# Altium project VESC6.PrjPcb
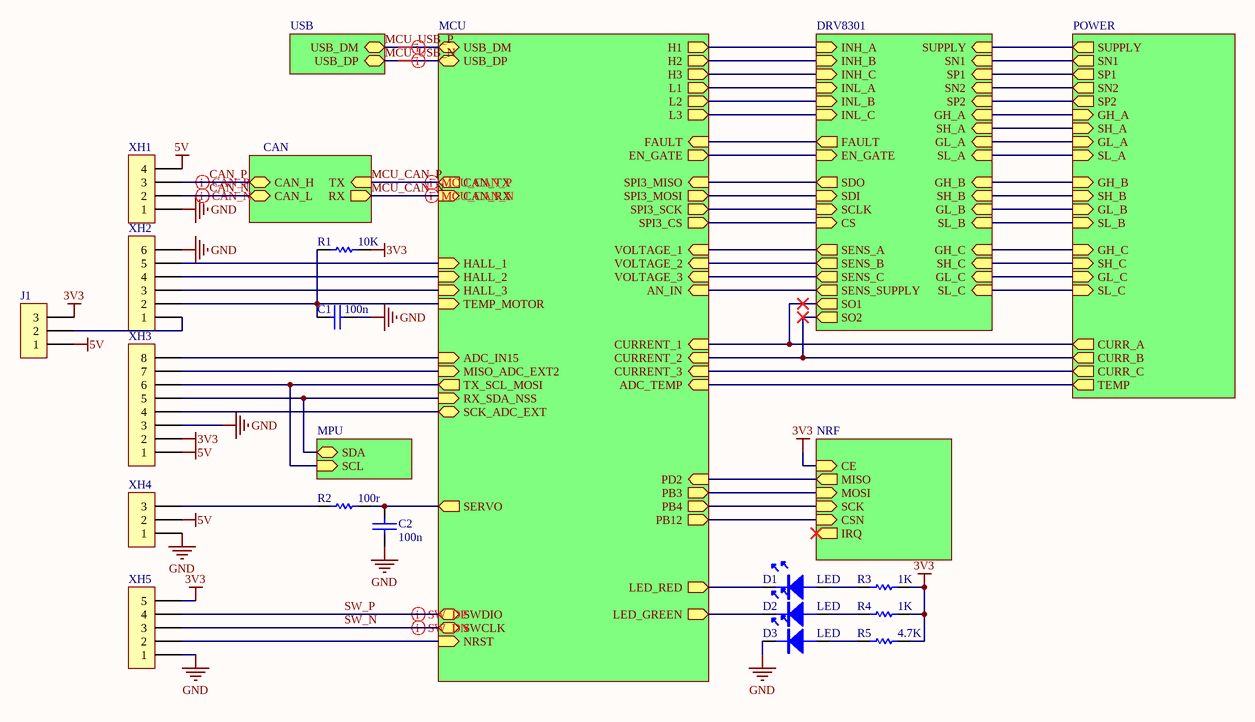
[diagram p0: VESC6.SchDoc]
8 sheets, 187 parts. Net scope: hierarchical (ports join the sheet entries above them; power ports are global).
Board file: VESC6.PcbDoc
Sheets:
  VESC6.SchDoc
    MCU = MCU.SchDoc
    DRV8301 = drv8301.SchDoc
    POWER = power.SchDoc
    NRF = nrf.SchDoc
    CAN = can.SchDoc
    MPU = MPU.SchDoc
    USB = USB.SchDoc

## Sheet VESC6.SchDoc
size A4; SheetNumber: 1; SheetTotal: 8

### Parts
C1  100n  [0603C]
C2  100n  [0603C]
D1  LED  [LED-0603Y]
D2  LED  [LED-0603Y]
D3  LED  [LED-0603Y]
J1  Pin HDR1X3  [Pin HDR1X3/2.54mm-S]  (value not drawn)
R1  10K  [0603R]
R2  100r  [0603R]
R3  1K  [0603R]
R4  1K  [0603R]
R5  4.7K  [0603R]
XH1  XH4  [XH4/2.54mm/90]  (value not drawn)
XH2  XH6  [XH6/2.54mm/90]  (value not drawn)
XH3  XH8  [XH8/2.54mm/90]  (value not drawn)
XH4  XH3  [XH3/2.54mm/90]  (value not drawn)
XH5  XH5  [XH5/2.54mm/90]  (value not drawn)

### Sub-sheets
CAN = can: TX (in), RX (out), CAN_H (bidir), CAN_L (bidir)
DRV8301 = drv8301.SchDoc: INH_A (in), INH_B (in), INH_C (in), INL_A (in), INL_B (in), INL_C (in), FAULT (out), EN_GATE (in), SDO (out), SDI (in), SCLK (in), CS (in), SENS_A (out), SENS_B (out), SENS_C (out), SENS_SUPPLY (out), SUPPLY (in), GH_A (in), SH_A (in), GL_A (in), SL_A (in), GH_B (in), SH_B (in), GL_B (in), SL_B (in), GH_C (in), SH_C (in), GL_C (in), SL_C (in), SN1 (in), SN2 (in), SP1 (in), SP2 (in), SO1 (out), SO2 (out)
MCU = MCU.SchDoc: H1 (out), H2 (out), H3 (out), L1 (out), L2 (out), L3 (out), FAULT (in), EN_GATE (out), SPI3_MISO (in), SPI3_MOSI (out), SPI3_SCK (out), SPI3_CS (out), VOLTAGE_1 (in), VOLTAGE_2 (in), VOLTAGE_3 (in), AN_IN (in), CURRENT_1 (in), CURRENT_2 (in), CURRENT_3 (in), ADC_TEMP (in), PD2 (in), PB3 (out), PB4 (out), PB12 (out), LED_RED (out), LED_GREEN (out), USB_DM (bidir), USB_DP (bidir), CAN_TX (out), CAN_RX (in), HALL_1 (in), HALL_2 (in), HALL_3 (in), TEMP_MOTOR (in), ADC_IN15 (in), MISO_ADC_EXT2 (in), TX_SCL_MOSI (out), RX_SDA_NSS (in), SCK_ADC_EXT (bidir), SERVO (out), SWCLK (bidir), SWDIO (bidir), NRST (in)
MPU = mpu: SCL (in), SDA (bidir)
NRF = nrf.schdoc: MISO (out), MOSI (in), SCK (in), CSN (in), IRQ (out), CE (in)
POWER = power: SUPPLY (out), GH_A (in), SH_A (in), GL_A (in), SL_A (in), GH_B (in), SH_B (in), GL_B (in), SL_B (in), GH_C (in), SH_C (in), GL_C (in), SL_C (in), CURR_A (out), CURR_B (out), CURR_C (out), TEMP (out), SN1 (out), SN2 (out), SP1 (out), SP2 (out)
USB = USB: USB_DM (bidir), USB_DP (bidir)

### Nets
3V3: J1.3 R1.2 R3.2 R4.2 R5.2 XH3.2 XH5.5 ; sheet NRF/CE
5V: J1.1 XH1.4 XH3.1 XH4.2
GND: C1.2 C2.1 D3.K XH1.1 XH2.6 XH3.3 XH4.1 XH5.1
PGND: sheet DRV8301/SL_A, sheet DRV8301/SP1, sheet DRV8301/SP2, sheet POWER/SL_A, sheet POWER/SP1, sheet POWER/SP2
SUPPLY: sheet DRV8301/SUPPLY, sheet POWER/SUPPLY
CAN_N: XH1.2 ; sheet CAN/CAN_L
CAN_P: XH1.3 ; sheet CAN/CAN_H
GH_A: sheet DRV8301/GH_A, sheet POWER/GH_A
GL_A: sheet DRV8301/GL_A, sheet POWER/GL_A
MCU_CAN_N: sheet MCU/CAN_RX, sheet CAN/RX
MCU_CAN_P: sheet MCU/CAN_TX, sheet CAN/TX
MCU_USB_N: sheet MCU/USB_DP, sheet USB/USB_DP
MCU_USB_P: sheet MCU/USB_DM, sheet USB/USB_DM
SENS_A: sheet MCU/VOLTAGE_1, sheet DRV8301/SENS_A
SENS_B: sheet MCU/VOLTAGE_2, sheet DRV8301/SENS_B
SENS_C: sheet MCU/VOLTAGE_3, sheet DRV8301/SENS_C
SENS_SUPPLY: sheet MCU/AN_IN, sheet DRV8301/SENS_SUPPLY
SH_A: sheet DRV8301/SH_A, sheet POWER/SH_A
SH_B: sheet DRV8301/SH_B, sheet POWER/SH_B
SH_C: sheet DRV8301/SH_C, sheet POWER/SH_C
SW_N: XH5.3 ; sheet MCU/SWCLK
SW_P: XH5.4 ; sheet MCU/SWDIO
TEMP: sheet MCU/ADC_TEMP, sheet POWER/TEMP
NetC1_1: C1.1 R1.1 XH2.2 ; sheet MCU/TEMP_MOTOR
NetC2_2: C2.2 R2.2 ; sheet MCU/SERVO
NetC12_1: XH5.2 ; sheet MCU/NRST
NetC16_1: sheet DRV8301/SL_B, sheet DRV8301/SN1, sheet POWER/SL_B, sheet POWER/SN1
NetC18_1: sheet DRV8301/SL_C, sheet DRV8301/SN2, sheet POWER/SL_C, sheet POWER/SN2
NetC23_2: sheet MCU/CURRENT_1, sheet DRV8301/SO1, sheet POWER/CURR_A
NetC25_2: sheet MCU/CURRENT_2, sheet DRV8301/SO2, sheet POWER/CURR_B
NetC26_2: sheet MCU/CURRENT_3, sheet POWER/CURR_C
NetD1_A: D1.A R3.1
NetD1_K: D1.K ; sheet MCU/LED_RED
NetD2_A: D2.A R4.1
NetD2_K: D2.K ; sheet MCU/LED_GREEN
NetD3_A: D3.A R5.1
NetJ1_2: J1.2 XH2.1
NetR2_1: R2.1 XH4.3
NetR8_1: sheet DRV8301/GH_B, sheet POWER/GH_B
NetR9_1: sheet DRV8301/GH_C, sheet POWER/GH_C
NetR14_1: sheet DRV8301/GL_B, sheet POWER/GL_B
NetR15_1: sheet DRV8301/GL_C, sheet POWER/GL_C
NetR35_1: XH3.6 ; sheet MCU/TX_SCL_MOSI, sheet MPU/SCL
NetR36_1: XH3.5 ; sheet MCU/RX_SDA_NSS, sheet MPU/SDA
NetU1_21: XH3.4 ; sheet MCU/SCK_ADC_EXT
NetU1_22: XH3.7 ; sheet MCU/MISO_ADC_EXT2
NetU1_25: XH3.8 ; sheet MCU/ADC_IN15
NetU1_33: sheet MCU/PB12, sheet NRF/CSN
NetU1_34: sheet MCU/L1, sheet DRV8301/INL_A
NetU1_35: sheet MCU/L2, sheet DRV8301/INL_B
NetU1_36: sheet MCU/L3, sheet DRV8301/INL_C
NetU1_37: XH2.5 ; sheet MCU/HALL_1
NetU1_38: XH2.4 ; sheet MCU/HALL_2
NetU1_39: XH2.3 ; sheet MCU/HALL_3
NetU1_40: sheet MCU/SPI3_CS, sheet DRV8301/CS
NetU1_41: sheet MCU/H1, sheet DRV8301/INH_A
NetU1_42: sheet MCU/H2, sheet DRV8301/INH_B
NetU1_43: sheet MCU/H3, sheet DRV8301/INH_C
NetU1_51: sheet MCU/SPI3_SCK, sheet DRV8301/SCLK
NetU1_52: sheet MCU/SPI3_MISO, sheet DRV8301/SDO
NetU1_53: sheet MCU/SPI3_MOSI, sheet DRV8301/SDI
NetU1_54: sheet MCU/PD2, sheet NRF/MISO
NetU1_55: sheet MCU/PB3, sheet NRF/MOSI
NetU1_56: sheet MCU/PB4, sheet NRF/SCK
NetU1_57: sheet MCU/EN_GATE, sheet DRV8301/EN_GATE
NetU1_59: sheet MCU/FAULT, sheet DRV8301/FAULT

### Layout directives
differential pair: CAN_N, CAN_P, MCU_CAN_N, MCU_CAN_P, MCU_USB_N, MCU_USB_P, SW_N, SW_P

### Library data of the parts
C1 C2 = CAP: 无极性电容
R1-R5 = RES

## Sheet MCU.SchDoc
size A4; SheetNumber: 2; SheetTotal: 8
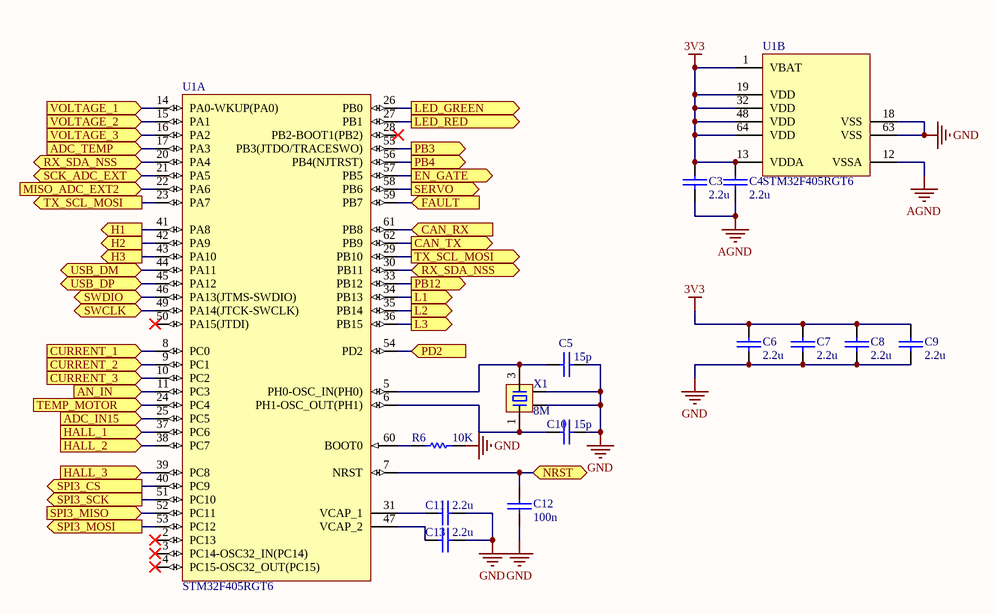
[diagram p1: MCU.SchDoc]

### Parts
C3  2.2u  [0603C]
C4  2.2u  [0603C]
C5  15p  [0603C]
C6  2.2u  [0603C]
C7  2.2u  [0603C]
C8  2.2u  [0603C]
C9  2.2u  [0603C]
C10  15p  [0603C]
C11  2.2u  [0603C]
C12  100n  [0603C]
C13  2.2u  [0603C]
R6  10K  [0603R]
U1  STM32F405RGT6  [STM-LQFP64_N]  (parts A,B of 2)
X1  8M  [OSC 5032-4P]

### Ports
ADC_IN15 (in), ADC_TEMP (in), AN_IN (in), CAN_RX (in), CAN_TX (out), CURRENT_1 (in), CURRENT_2 (in), CURRENT_3 (in), EN_GATE (out), FAULT (in), H1 (out), H2 (out), H3 (out), HALL_1 (in), HALL_2 (in), HALL_3 (in), L1 (out), L2 (out), L3 (out), LED_GREEN (out), LED_RED (out), MISO_ADC_EXT2 (in), NRST (bidir), PB3 (out), PB4 (out), PB12 (out), PD2 (in), RX_SDA_NSS (bidir), SCK_ADC_EXT (bidir), SERVO (out), SPI3_CS (out), SPI3_MISO (in), SPI3_MOSI (out), SPI3_SCK (out), SWCLK (bidir), SWDIO (bidir), TEMP_MOTOR (in), TX_SCL_MOSI (out), USB_DM (bidir), USB_DP (bidir), VOLTAGE_1 (in), VOLTAGE_2 (in), VOLTAGE_3 (in)

### Nets
3V3: C3.1 C4.1 C6.1 C7.1 C8.1 C9.1 U1.1(VBAT) U1.13(VDDA) U1.19(VDD) U1.32(VDD) U1.48(VDD) U1.64(VDD)
AGND: C3.2 C4.2 U1.12(VSSA)
GND: C5.1 C6.2 C7.2 C8.2 C9.2 C10.1 C11.1 C12.2 C13.1 R6.2 U1.18(VSS) U1.63(VSS) X1.2 X1.4
MCU_CAN_N: U1.61(PB8) ; port CAN_RX
MCU_CAN_P: U1.62(PB9) ; port CAN_TX
MCU_USB_N: U1.45(PA12) ; port USB_DP
MCU_USB_P: U1.44(PA11) ; port USB_DM
SENS_A: U1.14(PA0-WKUP(PA0)) ; port VOLTAGE_1
SENS_B: U1.15(PA1) ; port VOLTAGE_2
SENS_C: U1.16(PA2) ; port VOLTAGE_3
SENS_SUPPLY: U1.11(PC3) ; port AN_IN
SW_N: U1.49(PA14(JTCK-SWCLK)) ; port SWCLK
SW_P: U1.46(PA13(JTMS-SWDIO)) ; port SWDIO
TEMP: U1.17(PA3) ; port ADC_TEMP
NetC1_1: U1.24(PC4) ; port TEMP_MOTOR
NetC2_2: U1.58(PB6) ; port SERVO
NetC5_2: C5.2 U1.5(PH0-OSC_IN(PH0)) X1.3
NetC10_2: C10.2 U1.6(PH1-OSC_OUT(PH1)) X1.1
NetC11_2: C11.2 U1.31(VCAP_1)
NetC12_1: C12.1 U1.7(NRST) ; port NRST
NetC13_2: C13.2 U1.47(VCAP_2)
NetC23_2: U1.8(PC0) ; port CURRENT_1
NetC25_2: U1.9(PC1) ; port CURRENT_2
NetC26_2: U1.10(PC2) ; port CURRENT_3
NetD1_K: U1.27(PB1) ; port LED_RED
NetD2_K: U1.26(PB0) ; port LED_GREEN
NetR6_1: R6.1 U1.60(BOOT0)
NetR35_1: U1.23(PA7) U1.29(PB10) ; port TX_SCL_MOSI
NetR36_1: U1.20(PA4) U1.30(PB11) ; port RX_SDA_NSS
NetU1_21: U1.21(PA5) ; port SCK_ADC_EXT
NetU1_22: U1.22(PA6) ; port MISO_ADC_EXT2
NetU1_25: U1.25(PC5) ; port ADC_IN15
NetU1_33: U1.33(PB12) ; port PB12
NetU1_34: U1.34(PB13) ; port L1
NetU1_35: U1.35(PB14) ; port L2
NetU1_36: U1.36(PB15) ; port L3
NetU1_37: U1.37(PC6) ; port HALL_1
NetU1_38: U1.38(PC7) ; port HALL_2
NetU1_39: U1.39(PC8) ; port HALL_3
NetU1_40: U1.40(PC9) ; port SPI3_CS
NetU1_41: U1.41(PA8) ; port H1
NetU1_42: U1.42(PA9) ; port H2
NetU1_43: U1.43(PA10) ; port H3
NetU1_51: U1.51(PC10) ; port SPI3_SCK
NetU1_52: U1.52(PC11) ; port SPI3_MISO
NetU1_53: U1.53(PC12) ; port SPI3_MOSI
NetU1_54: U1.54(PD2) ; port PD2
NetU1_55: U1.55(PB3(JTDO/TRACESWO)) ; port PB3
NetU1_56: U1.56(PB4(NJTRST)) ; port PB4
NetU1_57: U1.57(PB5) ; port EN_GATE
NetU1_59: U1.59(PB7) ; port FAULT

Not connected (* = marked no-connect by the designer): U1 2(PC13)* 3(PC14-OSC32_IN(PC14))* 4(PC15-OSC32_OUT(PC15))* 28(PB2-BOOT1(PB2))* 50(PA15(JTDI))*

### Library data of the parts
C3-C13 = CAP: 无极性电容
R6 = RES
U1 = CMP-0243-00019-3: ARM Cortex-M4 32-bit MCU+FPU, 210 DMIPS, 1024 kB Flash, 192 kB Internal RAM, 51 I/Os, 64-pin LQFP, -40 to 85 degC, Tray; Manufacturer: STMicroelectronics; Supply Voltage(Vcc) min (V): 1.8; Supply Voltage(Vcc) max (V): 3.6; Internal RAM Size (kB): 192; I/Os (High Current): 51; D/A Converter: 2x12-bit; FLASH Size (Prog) (kB): 1024; Operating Frequency(F) (Processor speed) (MHz): 168; ComponentLink2Description: Datasheet; PackageVersion: Rev. 4, 06/2013; DatasheetVersion: Rev. 4; Core: ARM Cortex-M4; ComponentLink2URL: http://www.st.com/st-web-ui/static/active/en/resource/technical/document/datasheet/DM00037051.pdf; PackageReference: LQFP64; Packing: Tray; ComponentLink1Description: Manufacturer URL; ComponentLink3URL: http://www.st.com/st-web-ui/static/active/en/resource/technical/document/datasheet/DM00037051.pdf; ComponentLink3Description: Package Specification; Mounting Technology: Surface Mount; ComponentLink1URL: http://www.st.com/web/en/home.html; PackageDescription: 64-Pin Low Profile Quad Flat Package, 10 x 10 mm Body, 0.5 mm Pitch; PartNumber: STM32F405RGT6
X1 = XTAL-4P: 4脚无源晶振

## Sheet drv8301.SchDoc
size A4; SheetNumber: 4; SheetTotal: 8
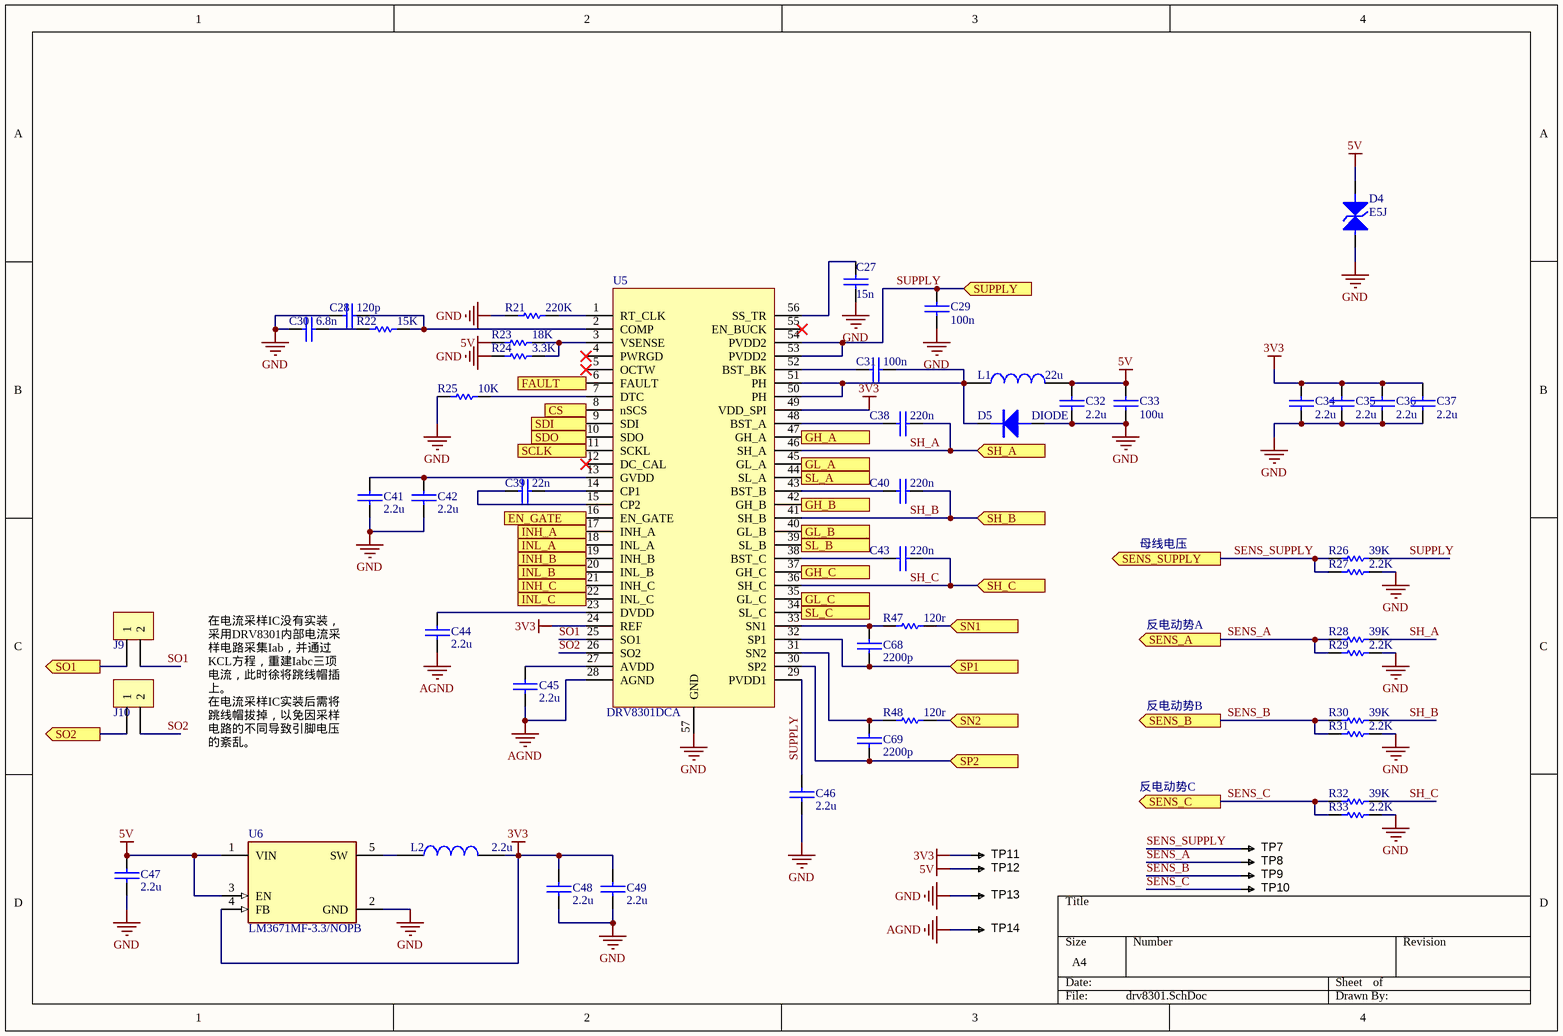
[diagram p2: drv8301.SchDoc]

### Parts
C27  15n  [0603C]
C28  120p  [0603C]
C29  100n  [0603C]
C30  6.8n  [0603C]
C31  100n  [0603C]
C32  2.2u  [0603C]
C33  100u  [0603C]
C34  2.2u  [0603C]
C35  2.2u  [0603C]
C36  2.2u  [0603C]
C37  2.2u  [0603C]
C38  220n  [0603C]
C39  22n  [0603C]
C40  220n  [0603C]
C41  2.2u  [0603C]
C42  2.2u  [0603C]
C43  220n  [0603C]
C44  2.2u  [0603C]
C45  2.2u  [0603C]
C46  2.2u  [0603C]
C47  2.2u  [0603C]
C48  2.2u  [0603C]
C49  2.2u  [0603C]
C68  2200p  [0603C]
C69  2200p  [0603C]
D4  E5J  [SOD-123]
D5  DIODE  [SMA/DO-214AC]
J9  Pin HDR1X2  [Pin HDR1X2/2.54mm-S]  (value not drawn)
J10  Pin HDR1X2  [Pin HDR1X2/2.54mm-S]  (value not drawn)
L1  22u  [0630L]
L2  2.2u  [0630L]
R21  220K  [0603R]
R22  15K  [0603R]
R23  18K  [0603R]
R24  3.3K  [0603R]
R25  10K  [0603R]
R26  39K  [0603R]
R27  2.2K  [0603R]
R28  39K  [0603R]
R29  2.2K  [0603R]
R30  39K  [0603R]
R31  2.2K  [0603R]
R32  39K  [0603R]
R33  2.2K  [0603R]
R47  120r  [0603R]
R48  120r  [0603R]
TP7  TESTPOINT  [FIDUCIAL]  (value not drawn)  (no BOM)
TP8  TESTPOINT  [FIDUCIAL]  (value not drawn)  (no BOM)
TP9  TESTPOINT  [FIDUCIAL]  (value not drawn)  (no BOM)
TP10  TESTPOINT  [FIDUCIAL]  (value not drawn)  (no BOM)
TP11  TESTPOINT  [FIDUCIAL]  (value not drawn)  (no BOM)
TP12  TESTPOINT  [FIDUCIAL]  (value not drawn)  (no BOM)
TP13  TESTPOINT  [FIDUCIAL]  (value not drawn)  (no BOM)
TP14  TESTPOINT  [FIDUCIAL]  (value not drawn)  (no BOM)
U5  DRV8301DCA  [TSSOP50P810X120_HS-57N]
U6  LM3671MF-3.3/NOPB  [FP-DBV0005A-MFG]

### Ports
CS (in), EN_GATE (in), FAULT (out), GH_A (in), GH_B (in), GH_C (in), GL_A (in), GL_B (in), GL_C (in), INH_A (in), INH_B (in), INH_C (in), INL_A (in), INL_B (in), INL_C (in), SCLK (in), SDI (in), SDO (out), SENS_A (out), SENS_B (out), SENS_C (out), SENS_SUPPLY (out), SH_A (in), SH_B (in), SH_C (in), SL_A (in), SL_B (in), SL_C (in), SN1 (in), SN2 (in), SO1 (out), SO2 (out), SP1 (in), SP2 (in), SUPPLY (in)

### Nets
3V3: C34.1 C35.1 C36.1 C37.1 C48.2 C49.2 L2.2 TP11.1 U5.24(REF) U5.49(VDD_SPI) U6.4(FB)
5V: C32.1 C33.1 C47.2 D4.K L1.2 R23.1 TP12.1 U6.1(VIN) U6.3(EN)
AGND: C44.1 C45.1 TP14.1 U5.28(AGND)
GND: C27.2 C28.2 C29.2 C30.2 C32.2 C33.2 C34.2 C35.2 C36.2 C37.2 C41.1 C42.1 C46.1 C47.1 C48.1 C49.1 D4.A D5.A R21.2 R24.2 R25.2 R27.1 R29.1 R31.1 R33.1 TP13.1 U5.57(GND) U6.2(GND)
PGND: C68.1 C69.1 U5.30(SP2) U5.32(SP1) U5.44(SL_A) ; port SL_A, port SP2, port SP1
SUPPLY: C29.1 C46.2 R26.1 U5.29(PVDD1) U5.53(PVDD2) U5.54(PVDD2) ; port SUPPLY
GH_A: U5.47(GH_A) ; port GH_A
GL_A: U5.45(GL_A) ; port GL_A
SENS_A: R28.2 R29.2 TP8.1 ; port SENS_A
SENS_B: R30.2 R31.2 TP9.1 ; port SENS_B
SENS_C: R32.2 R33.2 TP10.1 ; port SENS_C
SENS_SUPPLY: R26.2 R27.2 TP7.1 ; port SENS_SUPPLY
SH_A: C38.1 R28.1 U5.46(SH_A) ; port SH_A
SH_B: C40.1 R30.1 U5.41(SH_B) ; port SH_B
SH_C: C43.1 R32.1 U5.36(SH_C) ; port SH_C
SO1: J9.2 U5.25(SO1)
SO2: J10.2 U5.26(SO2)
NetC16_1: R47.1 U5.39(SL_B) ; port SL_B, port SN1
NetC18_1: R48.1 U5.34(SL_C) ; port SL_C, port SN2
NetC23_2: J9.1 ; port SO1
NetC25_2: J10.1 ; port SO2
NetC27_1: C27.1 U5.56(SS_TR)
NetC28_1: C28.1 R22.1 U5.2(COMP)
NetC30_1: C30.1 R22.2
NetC31_1: C31.1 D5.K L1.1 U5.50(PH) U5.51(PH)
NetC31_2: C31.2 U5.52(BST_BK)
NetC38_2: C38.2 U5.48(BST_A)
NetC39_1: C39.1 U5.14(CP1)
NetC39_2: C39.2 U5.15(CP2)
NetC40_2: C40.2 U5.43(BST_B)
NetC41_2: C41.2 C42.2 U5.13(GVDD)
NetC43_2: C43.2 U5.38(BST_C)
NetC44_2: C44.2 U5.23(DVDD)
NetC45_2: C45.2 U5.27(AVDD)
NetC68_2: C68.2 R47.2 U5.33(SN1)
NetC69_2: C69.2 R48.2 U5.31(SN2)
NetL2_1: L2.1 U6.5(SW)
NetR8_1: U5.42(GH_B) ; port GH_B
NetR9_1: U5.37(GH_C) ; port GH_C
NetR14_1: U5.40(GL_B) ; port GL_B
NetR15_1: U5.35(GL_C) ; port GL_C
NetR21_1: R21.1 U5.1(RT_CLK)
NetR23_2: R23.2 R24.1 U5.3(VSENSE)
NetR25_1: R25.1 U5.7(DTC)
NetU1_34: U5.18(INL_A) ; port INL_A
NetU1_35: U5.20(INL_B) ; port INL_B
NetU1_36: U5.22(INL_C) ; port INL_C
NetU1_40: U5.8(nSCS) ; port CS
NetU1_41: U5.17(INH_A) ; port INH_A
NetU1_42: U5.19(INH_B) ; port INH_B
NetU1_43: U5.21(INH_C) ; port INH_C
NetU1_51: U5.11(SCKL) ; port SCLK
NetU1_52: U5.10(SDO) ; port SDO
NetU1_53: U5.9(SDI) ; port SDI
NetU1_57: U5.16(EN_GATE) ; port EN_GATE
NetU1_59: U5.6(FAULT) ; port FAULT

Not connected (* = marked no-connect by the designer): U5 4(PWRGD)* 5(OCTW)* 12(DC_CAL)* 55(EN_BUCK)*

### Notes on the sheet
- 母线电压
- 反电动势A
- 反电动势B
- 在电流采样IC没有实装，采用DRV8301内部电流采样电路采集Iab，并通过KCL方程，重建Iabc三项电流，此时徐将跳线帽插上。
  在电流采样IC实装后需将跳线帽拔掉，以免因采样电路的不同导致引脚电压的紊乱。
- 反电动势C

### Library data of the parts
C27-C49 C68 C69 = CAP: 无极性电容
D4 = TVS: 双向瞬态抑制二极管
D5 = DIODE: 普通二极管
L1 L2 = INDUCTOR
R21-R33 R47 R48 = RES
TP7-TP14 = TESTPOINT: SMD test pin
U6 = CMP-0063-01132-4: IC REG BUCK 3.3V 600MA SOT23-5; Number of Outputs: 1; Min Supply Voltage: 2.7V; Frequency: 2MHz; Min Output Voltage: 1.1V; Max Supply Voltage: 5.5V; Output Type: Fixed; Switching Frequency: 2.6MHz; Quiescent Current: 16uA; Case/Package: SOT-23; Number of Pins: 5; Lead Free: Lead Free; Min Operating Temperature: -40°C; Length: 2.92mm; Packaging: Tape and Reel; Max Output Current: 600mA; Height: 1.02mm; Max Operating Temperature: 85°C; Mount: Surface Mount; REACH SVHC: No SVHC; Contact Plating: Tin; Output Current: 600mA; Min Input Voltage: 2.7V; RoHS Compliant: Yes; Output Voltage: 3.3V; Package Quantity: 1000; Max Output Voltage: 3.3V; Nominal Output Voltage: 3.3V; Width: 1.6mm; Max Input Voltage: 5.5V; Termination: SMD/SMT

## Sheet power.SchDoc
size A4; SheetNumber: 3; SheetTotal: 8
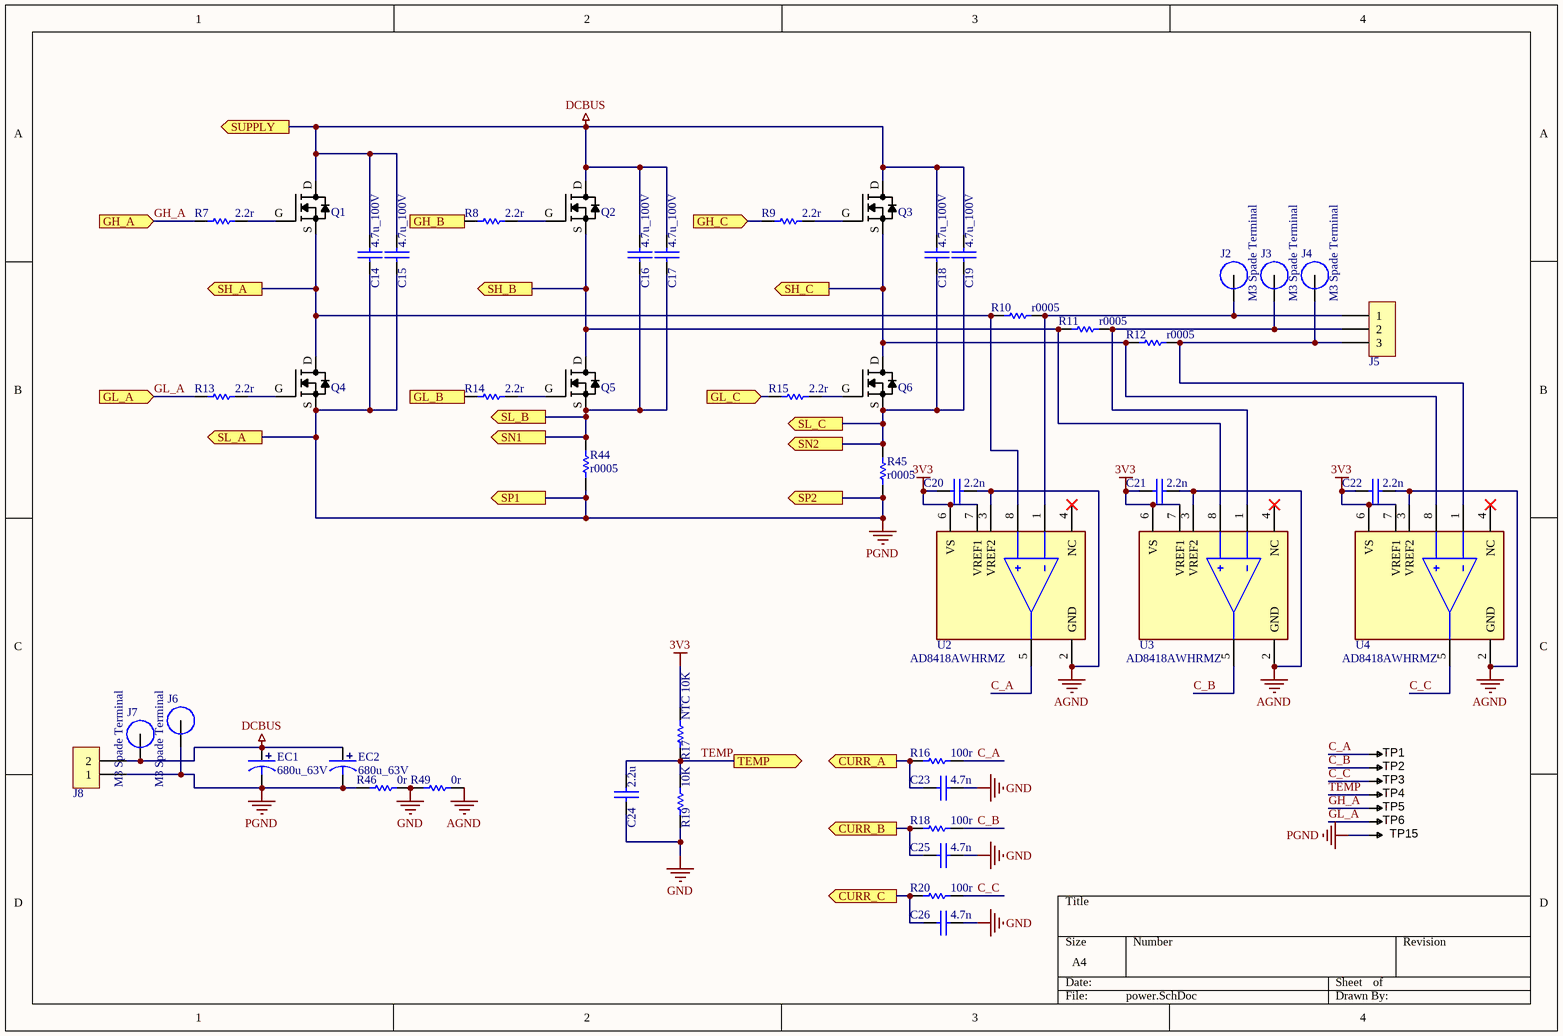
[diagram p3: power.SchDoc]

### Parts
C14  4.7u_100V  [1206C]
C15  4.7u_100V  [1206C]
C16  4.7u_100V  [1206C]
C17  4.7u_100V  [1206C]
C18  4.7u_100V  [1206C]
C19  4.7u_100V  [1206C]
C20  2.2n  [0603C]
C21  2.2n  [0603C]
C22  2.2n  [0603C]
C23  4.7n  [0603C]
C24  2.2u  [0603C]
C25  4.7n  [0603C]
C26  4.7n  [0603C]
EC1  680u_63V  [DIP-EC5.0X12.5X25]
EC2  680u_63V  [DIP-EC5.0X12.5X25]
J2  M3 Spade Terminal  [M3 Spade Hole]
J3  M3 Spade Terminal  [M3 Spade Hole]
J4  M3 Spade Terminal  [M3 Spade Hole]
J5  1704936  [1704936]  (value not drawn)
J6  M3 Spade Terminal  [M3 Spade Hole]
J7  M3 Spade Terminal  [M3 Spade Hole]
J8  1868076  [1868076]  (value not drawn)
Q1  FILL_FOOTPRINT  [SO8FL_VIAS]  (value not drawn)
Q2  FILL_FOOTPRINT  [SO8FL_VIAS]  (value not drawn)
Q3  FILL_FOOTPRINT  [SO8FL_VIAS]  (value not drawn)
Q4  FILL_FOOTPRINT  [SO8FL_VIAS]  (value not drawn)
Q5  FILL_FOOTPRINT  [SO8FL_VIAS]  (value not drawn)
Q6  FILL_FOOTPRINT  [SO8FL_VIAS]  (value not drawn)
R7  2.2r  [0603R]
R8  2.2r  [0603R]
R9  2.2r  [0603R]
R10  r0005  [2512R]
R11  r0005  [2512R]
R12  r0005  [2512R]
R13  2.2r  [0603R]
R14  2.2r  [0603R]
R15  2.2r  [0603R]
R16  100r  [0603R]
R17  NTC 10K  [0603R]
R18  100r  [0603R]
R19  10K  [0603R]
R20  100r  [0603R]
R44  r0005  [2512R]
R45  r0005  [2512R]
R46  0r  [0603R]
R49  0r  [0603R]
TP1  TESTPOINT  [FIDUCIAL]  (value not drawn)  (no BOM)
TP2  TESTPOINT  [FIDUCIAL]  (value not drawn)  (no BOM)
TP3  TESTPOINT  [FIDUCIAL]  (value not drawn)  (no BOM)
TP4  TESTPOINT  [FIDUCIAL]  (value not drawn)  (no BOM)
TP5  TESTPOINT  [FIDUCIAL]  (value not drawn)  (no BOM)
TP6  TESTPOINT  [FIDUCIAL]  (value not drawn)  (no BOM)
TP15  TESTPOINT  [FIDUCIAL]  (value not drawn)  (no BOM)
U2  AD8418AWHRMZ  [FP-RM-8-IPC_A]
U3  AD8418AWHRMZ  [FP-RM-8-IPC_A]
U4  AD8418AWHRMZ  [FP-RM-8-IPC_A]

### Ports
CURR_A (out), CURR_B (out), CURR_C (out), GH_A (in), GH_B (in), GH_C (in), GL_A (in), GL_B (in), GL_C (in), SH_A (out), SH_B (out), SH_C (out), SL_A (out), SL_B (out), SL_C (out), SN1 (out), SN2 (out), SP1 (out), SP2 (out), SUPPLY (out), TEMP (out)

### Nets
3V3: C20.2 C21.2 C22.2 R17.2 U2.6(VS) U2.7(VREF1) U3.6(VS) U3.7(VREF1) U4.6(VS) U4.7(VREF1)
AGND: C20.1 C21.1 C22.1 R49.1 U2.2(GND) U2.3(VREF2) U3.2(GND) U3.3(VREF2) U4.2(GND) U4.3(VREF2)
DCBUS: C14.2 C15.2 C16.2 C17.2 C18.2 C19.2 EC1.1 EC2.1 J7.1 J8.2 Q1.D Q2.D Q3.D ; port SUPPLY  [project net SUPPLY]
GND: C23.1 C24.1 C25.1 C26.1 R19.1 R46.1 R49.2
PGND: C14.1 C15.1 EC1.2 EC2.2 J6.1 J8.1 Q4.S R44.2 R45.2 R46.2 TP15.1 ; port SL_A, port SP1, port SP2
C_A: R16.1 TP1.1 U2.5(OUT)
C_B: R18.1 TP2.1 U3.5(OUT)
C_C: R20.1 TP3.1 U4.5(OUT)
GH_A: R7.1 TP5.1 ; port GH_A
GL_A: R13.1 TP6.1 ; port GL_A
SH_A: Q1.S Q4.D R10.2 U2.8(+IN) ; port SH_A
SH_B: Q2.S Q5.D R11.2 U3.8(+IN) ; port SH_B
SH_C: Q3.S Q6.D R12.2 U4.8(+IN) ; port SH_C
TEMP: C24.2 R17.1 R19.2 TP4.1 ; port TEMP
NetC16_1: C16.1 C17.1 Q5.S R44.1 ; port SL_B, port SN1
NetC18_1: C18.1 C19.1 Q6.S R45.1 ; port SL_C, port SN2
NetC23_2: C23.2 R16.2 ; port CURR_A
NetC25_2: C25.2 R18.2 ; port CURR_B
NetC26_2: C26.2 R20.2 ; port CURR_C
NetJ2_1: J2.1 J5.1 R10.1 U2.1(-IN)
NetJ3_1: J3.1 J5.2 R11.1 U3.1(-IN)
NetJ4_1: J4.1 J5.3 R12.1 U4.1(-IN)
NetQ1_G: Q1.G R7.2
NetQ2_G: Q2.G R8.2
NetQ3_G: Q3.G R9.2
NetQ4_G: Q4.G R13.2
NetQ5_G: Q5.G R14.2
NetQ6_G: Q6.G R15.2
NetR8_1: R8.1 ; port GH_B
NetR9_1: R9.1 ; port GH_C
NetR14_1: R14.1 ; port GL_B
NetR15_1: R15.1 ; port GL_C

Not connected (* = marked no-connect by the designer): U2 4(NC)*; U3 4(NC)*; U4 4(NC)*

### Library data of the parts
C14-C26 = CAP: 无极性电容
EC1 EC2 = DIP_ECAP: 直插电解电容
J5 = 1704936: CONN TERM BLOCK 3POS 7.62MM; Manufacturer: Phoenix Contact; Number of Levels: 1; Positions Per Level: 3; Pitch: 0.300" (7.62mm); Mating Orientation: Horizontal with Board; Current: 30A; Voltage: 300V; Wire Gauge: 10-30 AWG; Wire Termination: Screw - Rising Cage Clamp; Torque - Screw: 0.5-0.6 Nm (4.4-5.3 Lb-In); Screw Thread: M3; Supplier 1: Digi-Key; Supplier Part Number 1: 277-5954-ND; RoHS: RoHS Compliant; Category: Connectors, Interconnects; Stock: 3559; Pricing 1: 1=2.19, 10=2.128, 50=1.989, 100=1.8299, 250=1.69064, 500=1.61108, 1000=1.482 (USD); Packaging: Bulk; Part Status: Active; Mounting Type: Through Hole; Features: Interlocking (Side); Color: Green; Operating Temperature: -; Housing Material: Polyamide (PA), Nylon; Contact Material - Plating: -; Clamp Material - Plating: -; Screw Material - Plating: -; ComponentLink1URL: http://media.digikey.com/PDF/Data%20Sheets/Phoenix%20Contact%20PDFs/1704936.pdf; ComponentLink1Description: http://media.digikey.com/PDF/Data%20Sheets/Phoenix%20Contact%20PDFs/1704936.pdf; Manufacturer Part Number: 1704936
J8 = 1868076: CONN TERM BLOCK 2POS 7.62MM; Manufacturer: Phoenix Contact; Number of Levels: 1; Positions Per Level: 2; Pitch: 0.300" (7.62mm); Mating Orientation: Horizontal with Board; Current: 30A; Voltage: 300V; Wire Gauge: 10-30 AWG; Wire Termination: Screw - Rising Cage Clamp; Torque - Screw: 0.5-0.6 Nm (4.4-5.3 Lb-In); Screw Thread: M3; Supplier 1: Digi-Key; Supplier Part Number 1: 277-5840-ND; RoHS: RoHS Compliant; Category: Connectors, Interconnects; Stock: 2175; Pricing 1: 1=1.56, 10=1.517, 50=1.4178, 100=1.3044, 250=1.20512, 500=1.14842, 1000=1.0564 (USD); Packaging: Bulk; Part Status: Active; Mounting Type: Through Hole; Features: Interlocking (Side); Color: Green; Operating Temperature: -; Housing Material: Polyamide (PA), Nylon; Contact Material - Plating: -; Clamp Material - Plating: -; Screw Material - Plating: -; ComponentLink1URL: http://media.digikey.com/PDF/Data%20Sheets/Phoenix%20Contact%20PDFs/1868076.pdf; ComponentLink1Description: http://media.digikey.com/PDF/Data%20Sheets/Phoenix%20Contact%20PDFs/1868076.pdf
Q1-Q6 = NTMFS4935NT1G_1: MOSFET N-CH 30V 13A SO8FL; Manufacturer: ON Semiconductor; FET Type: N-Channel; Current - Continuous Drain (Id) @ 25°C: 13A (Ta), 93A (Tc); Drive Voltage (Max Rds On,  Min Rds On): 4.5V, 10V; Vgs(th) (Max) @ Id: 2.2V @ 250µA; Gate Charge (Qg) (Max) @ Vgs: 49.4nC @ 10V; Input Capacitance (Ciss) (Max) @ Vds: 4850pF @ 15V; Vgs (Max): ±20V; Power Dissipation (Max): 930mW (Ta), 48W (Tc); Rds On (Max) @ Id, Vgs: 3.2 mOhm @ 30A, 10V; Supplier 1: Digi-Key; Supplier Part Number 1: NTMFS4935NT1GOSCT-ND; RoHS: RoHS Compliant; Category: Discrete Semiconductor Products; Stock 1: 932; Pricing 1: 1=0.61, 10=0.541, 100=0.4145, 500=0.3277 (USD); Packaging: Cut Tape (CT); Part Status: Active; Technology: MOSFET (Metal Oxide); Drain to Source Voltage (Vdss): 30V; FET Feature: -; Operating Temperature: -55°C ~ 150°C (TJ); Mounting Type: Surface Mount; Supplier Device Package: 5-DFN (5x6) (8-SOFL); Package / Case: 8-PowerTDFN, 5 Leads; ComponentLink1URL: http://www.onsemi.com/pub_link/Collateral/NTMFS4935N-D.PDF; ComponentLink1Description: http://www.onsemi.com/pub_link/Collateral/NTMFS4935N-D.PDF; Manufacturer Part Number: NTMFS4935NT1G
R7-R20 R44-R46 R49 = RES
TP1-TP6 TP15 = TESTPOINT: SMD test pin
U2-U4 = CMP-09116-000167-1: IC CURR SENSE 1 CIRCUIT 8MSOP; Input Offset Voltage (Vos): 200uV; Number of Circuits: 1; Operating Supply Current: 4.1mA; Common Mode Rejection Ratio: 90dB; Input Bias Current: 130uA; Min Dual Supply Voltage: 1.35V; Max Dual Supply Voltage: 2.75V; Slew Rate: 1V/µs; Min Supply Voltage: 2.7V; Max Supply Voltage: 5.5V; -3db Bandwidth: 250kHz; Power Supply Rejection Ratio (PSRR): 80dB; Input Capacitance: 2pF; Number of Pins: 8; Max Operating Temperature: 125°C; Lead Free: Contains Lead; Mount: Surface Mount; Case/Package: MSOP; Min Operating Temperature: -40°C; Contact Plating: Tin; Packaging: Rail/Tube; RoHS Compliant: Yes

## Sheet nrf.SchDoc
size A4; SheetNumber: 5; SheetTotal: 8
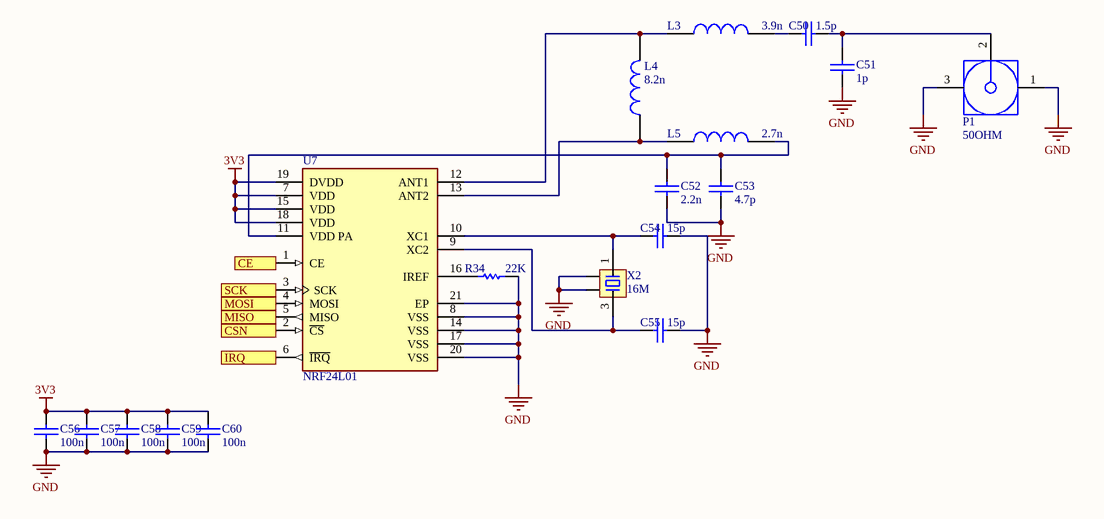
[diagram p4: nrf.SchDoc]

### Parts
C50  1.5p  [0603C]
C51  1p  [0603C]
C52  2.2n  [0603C]
C53  4.7p  [0603C]
C54  15p  [0603C]
C55  15p  [0603C]
C56  100n  [0603C]
C57  100n  [0603C]
C58  100n  [0603C]
C59  100n  [0603C]
C60  100n  [0603C]
L3  3.9n  [0603L]
L4  8.2n  [0603L]
L5  2.7n  [0603L]
P1  50OHM  [IPEX]
R34  22K  [0603R]
U7  NRF24L01  [FP-NRF24L01-IPC_C]
X2  16M  [OSC 3225-4P]

### Ports
CE (in), CSN (in), IRQ (out), MISO (out), MOSI (in), SCK (in)

### Nets
3V3: C56.2 C57.2 C58.2 C59.2 C60.2 U7.1(CE) U7.7(VDD) U7.15(VDD) U7.18(VDD) U7.19(DVDD) ; port CE
GND: C51.2 C52.1 C53.1 C54.1 C55.1 C56.1 C57.1 C58.1 C59.1 C60.1 P1.1 P1.3 R34.2 U7.8(VSS) U7.14(VSS) U7.17(VSS) U7.20(VSS) U7.21(EP) X2.2 X2.4
NetC50_1: C50.1 C51.1 P1.2
NetC50_2: C50.2 L3.2
NetC52_2: C52.2 C53.2 L5.2 U7.11(VDD_PA)
NetC54_2: C54.2 U7.10(XC1) X2.1
NetC55_2: C55.2 U7.9(XC2) X2.3
NetL3_1: L3.1 L4.2 U7.12(ANT1)
NetL4_1: L4.1 L5.1 U7.13(ANT2)
NetR34_1: R34.1 U7.16(IREF)
NetU1_33: U7.2(~{CS}) ; port CSN
NetU1_54: U7.5(MISO) ; port MISO
NetU1_55: U7.4(MOSI) ; port MOSI
NetU1_56: U7.3(SCK) ; port SCK
NetU7_6: U7.6(~{IRQ}) ; port IRQ

### Library data of the parts
C50-C60 = CAP: 无极性电容
L3-L5 = INDUCTOR
P1 = IPEX: RF Coaxial PCB Connector, MCX; Thru-Hole, Right-Angle Mount Socket, Blunt Post Terminal, 50 Ohm Impedance; PCB_Layout: Complies with manufacturer's recommendation.; DrillSize: Corresponds to nominal value.; Published: 15-Jul-2004; LatestRevisionDate: 15-Jul-2004; LatestRevisionNote: Component Replaced.; DatasheetDocument: 30-May-2003; PackageDocument: 04-Jul-1999; PackageReference: 919-119J-51AX; Publisher: Altium Limited; ComponentLink1Description: Manufacturer Link; ComponentLink1URL: http://www.amphenolrf.com/
R34 = RES
U7 = CMP-228436-000003-1: IC RF TXRX ISM>1GHZ 20VFQFN
X2 = XTAL-4P: 4脚无源晶振

## Sheet can.SchDoc
size A4; SheetNumber: 7; SheetTotal: 8
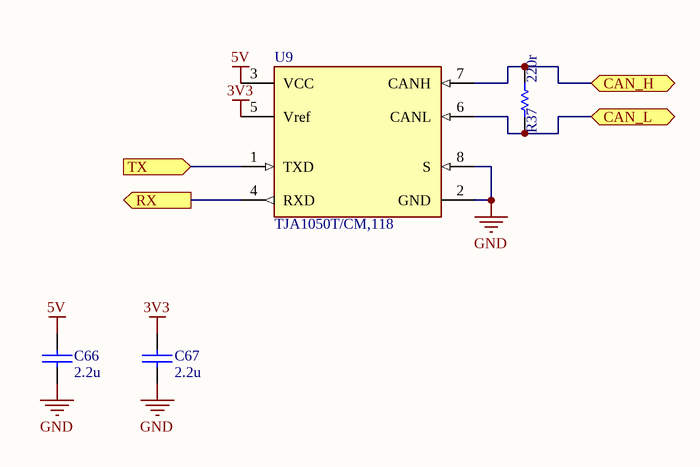
[diagram p5: can.SchDoc]

### Parts
C66  2.2u  [0603C]
C67  2.2u  [0603C]
R37  220r  [0603R]
U9  TJA1050T/CM,118  [FP-SOT96-1-IPC_A]

### Ports
CAN_H (bidir), CAN_L (bidir), RX (out), TX (in)

### Nets
3V3: C67.2 U9.5(Vref)
5V: C66.2 U9.3(VCC)
GND: C66.1 C67.1 U9.2(GND) U9.8(S)
CAN_N: R37.1 U9.6(CANL) ; port CAN_L
CAN_P: R37.2 U9.7(CANH) ; port CAN_H
MCU_CAN_N: U9.4(RXD) ; port RX
MCU_CAN_P: U9.1(TXD) ; port TX

### Library data of the parts
C66 C67 = CAP: 无极性电容
R37 = RES
U9 = CMP-2000-04923-2: IC TRANSCEIVER HALF 1/1 8SO; Simplex/Duplex: Half Duplex; Max Supply Current: 10mA; Number of Receive Buffers: 1; Min Supply Voltage: 4.75V; Max Supply Voltage: 5.25V; Interface: CAN; Data Rate: 1Mbps; Receiver Hysteresis: 70mV; Number of Transmit Buffers: 1; Min Operating Temperature: -40°C; Case/Package: SO; REACH SVHC: No SVHC; Max Operating Temperature: 150°C; Number of Pins: 8; Lead Free: Lead Free; Number of Transceivers: 1; Packaging: Tape and Reel; Mount: Surface Mount; Radiation Hardening: No; Nominal Supply Current: 10mA; Package Quantity: 2500; Contact Plating: Gold

## Sheet MPU.SchDoc
size A4; SheetNumber: 6; SheetTotal: 8
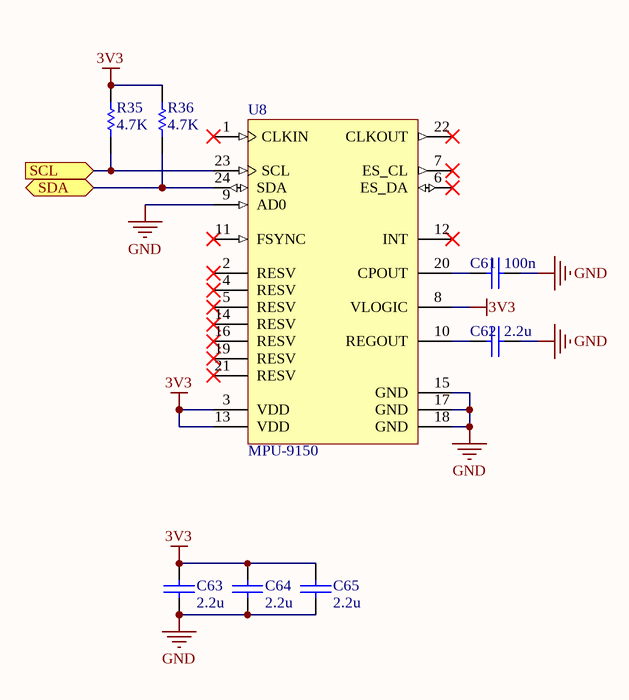
[diagram p6: MPU.SchDoc]

### Parts
C61  100n  [0603C]
C62  2.2u  [0603C]
C63  2.2u  [0603C]
C64  2.2u  [0603C]
C65  2.2u  [0603C]
R35  4.7K  [0603R]
R36  4.7K  [0603R]
U8  MPU-9150  [IS-QFN-24_4000X4000X1100_V]

### Ports
SCL (in), SDA (bidir)

### Nets
3V3: C63.2 C64.2 C65.2 R35.2 R36.2 U8.3(VDD) U8.8(VLOGIC) U8.13(VDD)
GND: C61.2 C62.2 C63.1 C64.1 C65.1 U8.9(AD0) U8.15(GND) U8.17(GND) U8.18(GND)
NetC61_1: C61.1 U8.20(CPOUT)
NetC62_1: C62.1 U8.10(REGOUT)
NetR35_1: R35.1 U8.23(SCL) ; port SCL
NetR36_1: R36.1 U8.24(SDA) ; port SDA

Not connected (* = marked no-connect by the designer): U8 1(CLKIN)* 2(RESV)* 4(RESV)* 5(RESV)* 6(ES_DA)* 7(ES_CL)* 11(FSYNC)* 12(INT)* 14(RESV)* 16(RESV)* 19(RESV)* 21(RESV)* 22(CLKOUT)*

### Library data of the parts
C61-C65 = CAP: 无极性电容
R35 R36 = RES
U8 = CMP-2000-05158-1: 9-Axis MotionTracking Device, 2.375 to 3.465 V, -40 to 85 degC, 24-Pin QFN, RoHS, Tape and Reel; Manufacturer: InvenSense; Featured Product: MPU-9150Nine-Axis(Gyro+Accelerometer+Compass)MEMSMotionTracking™Device; Output Type: I²C; PCN Obsolescence/ EOL: MPU-9150Devices25/Mar/2015; Sensor Type: Accelerometer,Gyroscope,Magnetometer,3Axis; Other Names: 1428-1009-2 / MPU9150; For Use With: 1471-1460-ND / -MPU9DOFCLICK / 1568-1017-ND / -MPU-9150GYROACCELIMU9DOF / 1428-1010-ND / -BOARDEVALFORMPU-9150; Manufacturer URL: http://www.invensense.com/; Category: Sensors,Transducers; Operating Temperature: -40degC~85degC(TA); Datasheet URL: http://datasheet.octopart.com/MPU-9150-InvenSense-datasheet-11519227.pdf; Series: MotionTracking™; Datasheet Version: Rev. 4.0, 05/2012; Family: Multifunction; Standard Package: 5,000

## Sheet USB.SchDoc
size A4; SheetNumber: 8; SheetTotal: 8
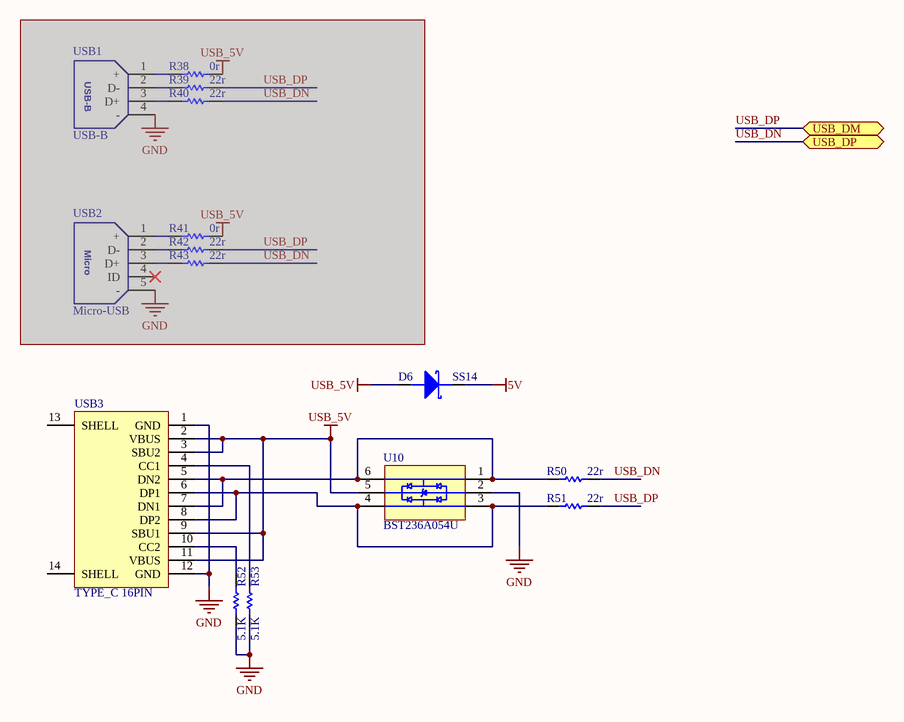
[diagram p7: USB.SchDoc]

### Parts
D6  SS14  [SMA/DO-214AC]
R38  0r  [0603R]  (masked out: inside a compile mask, not in the netlist)
R39  22r  [0603R]  (masked out: inside a compile mask, not in the netlist)
R40  22r  [0603R]  (masked out: inside a compile mask, not in the netlist)
R41  0r  [0603R]  (masked out: inside a compile mask, not in the netlist)
R42  22r  [0603R]  (masked out: inside a compile mask, not in the netlist)
R43  22r  [0603R]  (masked out: inside a compile mask, not in the netlist)
R50  22r  [0603R]
R51  22r  [0603R]
R52  5.1K  [0603R]
R53  5.1K  [0603R]
U10  BST236A054U  [SOT23-6M]
USB1  USB-B  [USB-B/S_A]  (masked out: inside a compile mask, not in the netlist)
USB2  Micro-USB  [USB-MICRO_A]  (masked out: inside a compile mask, not in the netlist)
USB3  TYPE_C 16PIN  [USB-C-SMD_TYPE-C-6PIN-2MD-073]

### Ports
USB_DM (bidir), USB_DP (bidir)

### Nets
5V: D6.K
GND: R52.1 R53.1 U10.2 USB3.1(GND) USB3.12(GND)
USB_5V: D6.A U10.5 USB3.2(VBUS) USB3.3(SBU2) USB3.9(SBU1) USB3.11(VBUS)
USB_DN: R50.2 ; port USB_DP  [project net MCU_USB_N]
USB_DP: R51.2 ; port USB_DM  [project net MCU_USB_P]
NetR50_1: R50.1 U10.1 U10.6 USB3.5(DN2) USB3.7(DN1)
NetR51_1: R51.1 U10.3 U10.4 USB3.6(DP1) USB3.8(DP2)
NetR52_2: R52.2 USB3.10(CC2)
NetR53_2: R53.2 USB3.4(CC1)

Not connected (* = marked no-connect by the designer): USB3 13(SHELL) 14(SHELL)

### Notes on the sheet
- (in symbol Micro-USB) Micro

### Library data of the parts
D6 = DIODE SCHOTTKY: 肖特基二极管
R38-R43 R50-R53 = RES
USB3 = TYPE-C 16PIN

## Nets that join several sheets
3V3: VESC6 (7 pins), MCU (12 pins), drv8301 (11 pins), power (10 pins), nrf (10 pins), can (C67.2 U9.5), MPU (8 pins)
5V: VESC6 (J1.1 XH1.4 XH3.1 XH4.2), drv8301 (9 pins), can (C66.2 U9.3), USB (D6.K)
AGND: MCU (C3.2 C4.2 U1.12), drv8301 (C44.1 C45.1 TP14.1 U5.28), power (10 pins)
GND: VESC6 (8 pins), MCU (14 pins), drv8301 (28 pins), power (7 pins), nrf (20 pins), can (C66.1 C67.1 U9.2 U9.8), MPU (9 pins), USB (5 pins)
PGND: drv8301 (5 pins), power (11 pins)
SUPPLY: drv8301 (6 pins), power (13 pins)
CAN_N: VESC6 (XH1.2), can (R37.1 U9.6)
CAN_P: VESC6 (XH1.3), can (R37.2 U9.7)
GH_A: drv8301 (U5.47), power (R7.1 TP5.1)
GL_A: drv8301 (U5.45), power (R13.1 TP6.1)
MCU_CAN_N: MCU (U1.61), can (U9.4)
MCU_CAN_P: MCU (U1.62), can (U9.1)
MCU_USB_N: MCU (U1.45), USB (R50.2)
MCU_USB_P: MCU (U1.44), USB (R51.2)
NetC1_1: VESC6 (C1.1 R1.1 XH2.2), MCU (U1.24)
NetC2_2: VESC6 (C2.2 R2.2), MCU (U1.58)
NetC12_1: VESC6 (XH5.2), MCU (C12.1 U1.7)
NetC16_1: drv8301 (R47.1 U5.39), power (C16.1 C17.1 Q5.S R44.1)
NetC18_1: drv8301 (R48.1 U5.34), power (C18.1 C19.1 Q6.S R45.1)
NetC23_2: MCU (U1.8), drv8301 (J9.1), power (C23.2 R16.2)
NetC25_2: MCU (U1.9), drv8301 (J10.1), power (C25.2 R18.2)
NetC26_2: MCU (U1.10), power (C26.2 R20.2)
NetD1_K: VESC6 (D1.K), MCU (U1.27)
NetD2_K: VESC6 (D2.K), MCU (U1.26)
NetR8_1: drv8301 (U5.42), power (R8.1)
NetR9_1: drv8301 (U5.37), power (R9.1)
NetR14_1: drv8301 (U5.40), power (R14.1)
NetR15_1: drv8301 (U5.35), power (R15.1)
NetR35_1: VESC6 (XH3.6), MCU (U1.23 U1.29), MPU (R35.1 U8.23)
NetR36_1: VESC6 (XH3.5), MCU (U1.20 U1.30), MPU (R36.1 U8.24)
NetU1_21: VESC6 (XH3.4), MCU (U1.21)
NetU1_22: VESC6 (XH3.7), MCU (U1.22)
NetU1_25: VESC6 (XH3.8), MCU (U1.25)
NetU1_33: MCU (U1.33), nrf (U7.2)
NetU1_34: MCU (U1.34), drv8301 (U5.18)
NetU1_35: MCU (U1.35), drv8301 (U5.20)
NetU1_36: MCU (U1.36), drv8301 (U5.22)
NetU1_37: VESC6 (XH2.5), MCU (U1.37)
NetU1_38: VESC6 (XH2.4), MCU (U1.38)
NetU1_39: VESC6 (XH2.3), MCU (U1.39)
NetU1_40: MCU (U1.40), drv8301 (U5.8)
NetU1_41: MCU (U1.41), drv8301 (U5.17)
NetU1_42: MCU (U1.42), drv8301 (U5.19)
NetU1_43: MCU (U1.43), drv8301 (U5.21)
NetU1_51: MCU (U1.51), drv8301 (U5.11)
NetU1_52: MCU (U1.52), drv8301 (U5.10)
NetU1_53: MCU (U1.53), drv8301 (U5.9)
NetU1_54: MCU (U1.54), nrf (U7.5)
NetU1_55: MCU (U1.55), nrf (U7.4)
NetU1_56: MCU (U1.56), nrf (U7.3)
NetU1_57: MCU (U1.57), drv8301 (U5.16)
NetU1_59: MCU (U1.59), drv8301 (U5.6)
SENS_A: MCU (U1.14), drv8301 (R28.2 R29.2 TP8.1)
SENS_B: MCU (U1.15), drv8301 (R30.2 R31.2 TP9.1)
SENS_C: MCU (U1.16), drv8301 (R32.2 R33.2 TP10.1)
SENS_SUPPLY: MCU (U1.11), drv8301 (R26.2 R27.2 TP7.1)
SH_A: drv8301 (C38.1 R28.1 U5.46), power (Q1.S Q4.D R10.2 U2.8)
SH_B: drv8301 (C40.1 R30.1 U5.41), power (Q2.S Q5.D R11.2 U3.8)
SH_C: drv8301 (C43.1 R32.1 U5.36), power (Q3.S Q6.D R12.2 U4.8)
SW_N: VESC6 (XH5.3), MCU (U1.49)
SW_P: VESC6 (XH5.4), MCU (U1.46)
TEMP: MCU (U1.17), power (C24.2 R17.1 R19.2 TP4.1)